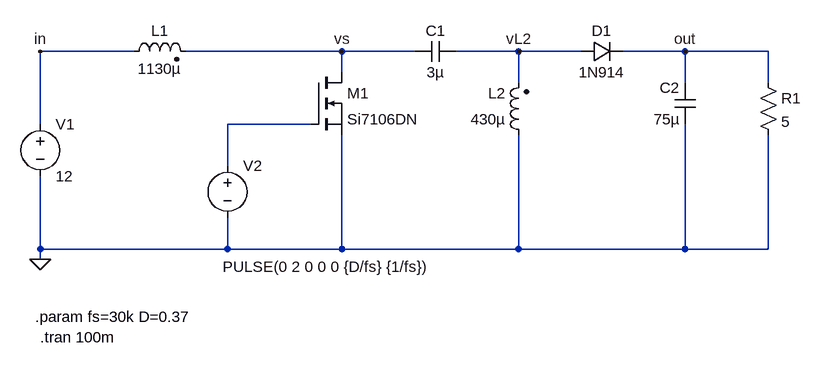
[diagram p0: schematic Simulação.asc]
Simulação.asc, the LTspice schematic file:
Version 4
SHEET 1 1096 680
WIRE 0 32 -144 32
WIRE 320 32 80 32
WIRE 432 32 320 32
WIRE 592 32 496 32
WIRE 688 32 592 32
WIRE 848 32 752 32
WIRE 976 32 848 32
WIRE 320 64 320 32
WIRE 592 80 592 32
WIRE 848 80 848 32
WIRE 976 80 976 32
WIRE -144 144 -144 32
WIRE 272 144 144 144
WIRE 144 208 144 144
WIRE -144 336 -144 224
WIRE 144 336 144 288
WIRE 144 336 -144 336
WIRE 320 336 320 160
WIRE 320 336 144 336
WIRE 592 336 592 160
WIRE 592 336 320 336
WIRE 848 336 848 144
WIRE 848 336 592 336
WIRE 976 336 976 160
WIRE 976 336 848 336
WIRE -144 352 -144 336
FLAG -144 352 0
FLAG -144 32 in
FLAG 848 32 out
FLAG 320 32 vs
FLAG 592 32 vL2
SYMBOL voltage -144 128 R0
WINDOW 123 0 0 Left 0
WINDOW 39 0 0 Left 0
SYMATTR InstName V1
SYMATTR Value 12
SYMBOL voltage 144 192 R0
WINDOW 3 -7 171 Left 2
WINDOW 123 0 0 Left 0
WINDOW 39 0 0 Left 0
SYMATTR Value PULSE(0 2 0 0 0 {D/fs} {1/fs})
SYMATTR InstName V2
SYMBOL nmos 272 64 R0
SYMATTR InstName M1
SYMATTR Value Si7106DN
SYMBOL ind2 -16 48 R270
WINDOW 0 32 56 VTop 2
WINDOW 3 5 56 VBottom 2
SYMATTR InstName L1
SYMATTR Value 1130µ
SYMATTR Type ind
SYMATTR SpiceLine Rser=1m
SYMBOL ind2 608 176 R180
WINDOW 0 36 80 Left 2
WINDOW 3 36 40 Left 2
SYMATTR InstName L2
SYMATTR Value 430µ
SYMATTR Type ind
SYMATTR SpiceLine Rser=1m
SYMBOL cap 496 16 R90
WINDOW 0 0 32 VBottom 2
WINDOW 3 32 32 VTop 2
SYMATTR InstName C1
SYMATTR Value 3µ
SYMATTR SpiceLine Rser=1m
SYMBOL cap 864 144 R180
WINDOW 0 24 56 Left 2
WINDOW 3 24 8 Left 2
SYMATTR InstName C2
SYMATTR Value 75µ
SYMATTR SpiceLine Rser=1m
SYMBOL res 960 64 R0
SYMATTR InstName R1
SYMATTR Value 5
SYMBOL diode 688 48 R270
WINDOW 0 32 32 VTop 2
WINDOW 3 0 32 VBottom 2
SYMATTR InstName D1
SYMATTR Value 1N914
TEXT -144 472 Left 2 !.tran 100m
TEXT -152 440 Left 2 !.param fs=30k D=0.37

The netlist it stands for:
* Simulação.asc
V1 in 0 12
V2 N001 0 PULSE(0 2 0 0 0 {D/fs} {1/fs})
M1 vs N001 0 0 Si7106DN
L1 in vs 1130µ Rser=1m
L2 0 vL2 430µ Rser=1m
C1 vL2 vs 3µ Rser=1m
C2 0 out 75µ Rser=1m
R1 out 0 5
D1 vL2 out 1N914
.model D D
.lib standard.dio
.model NMOS NMOS
.model PMOS PMOS
.lib standard.mos
.tran 100m
.param fs=30k D=0.37
.backanno
.end